# EasyEDA Pro project jlcProject.epro, schematic Schematic1_1
Create Date: 2025-04-09; Page Name: P1; Project Name: 电综; Schematic Name: Schematic1_1; Update Date: 2025-04-14; Company: 嘉立创EDA; Page Size: A4; Version: V1.0
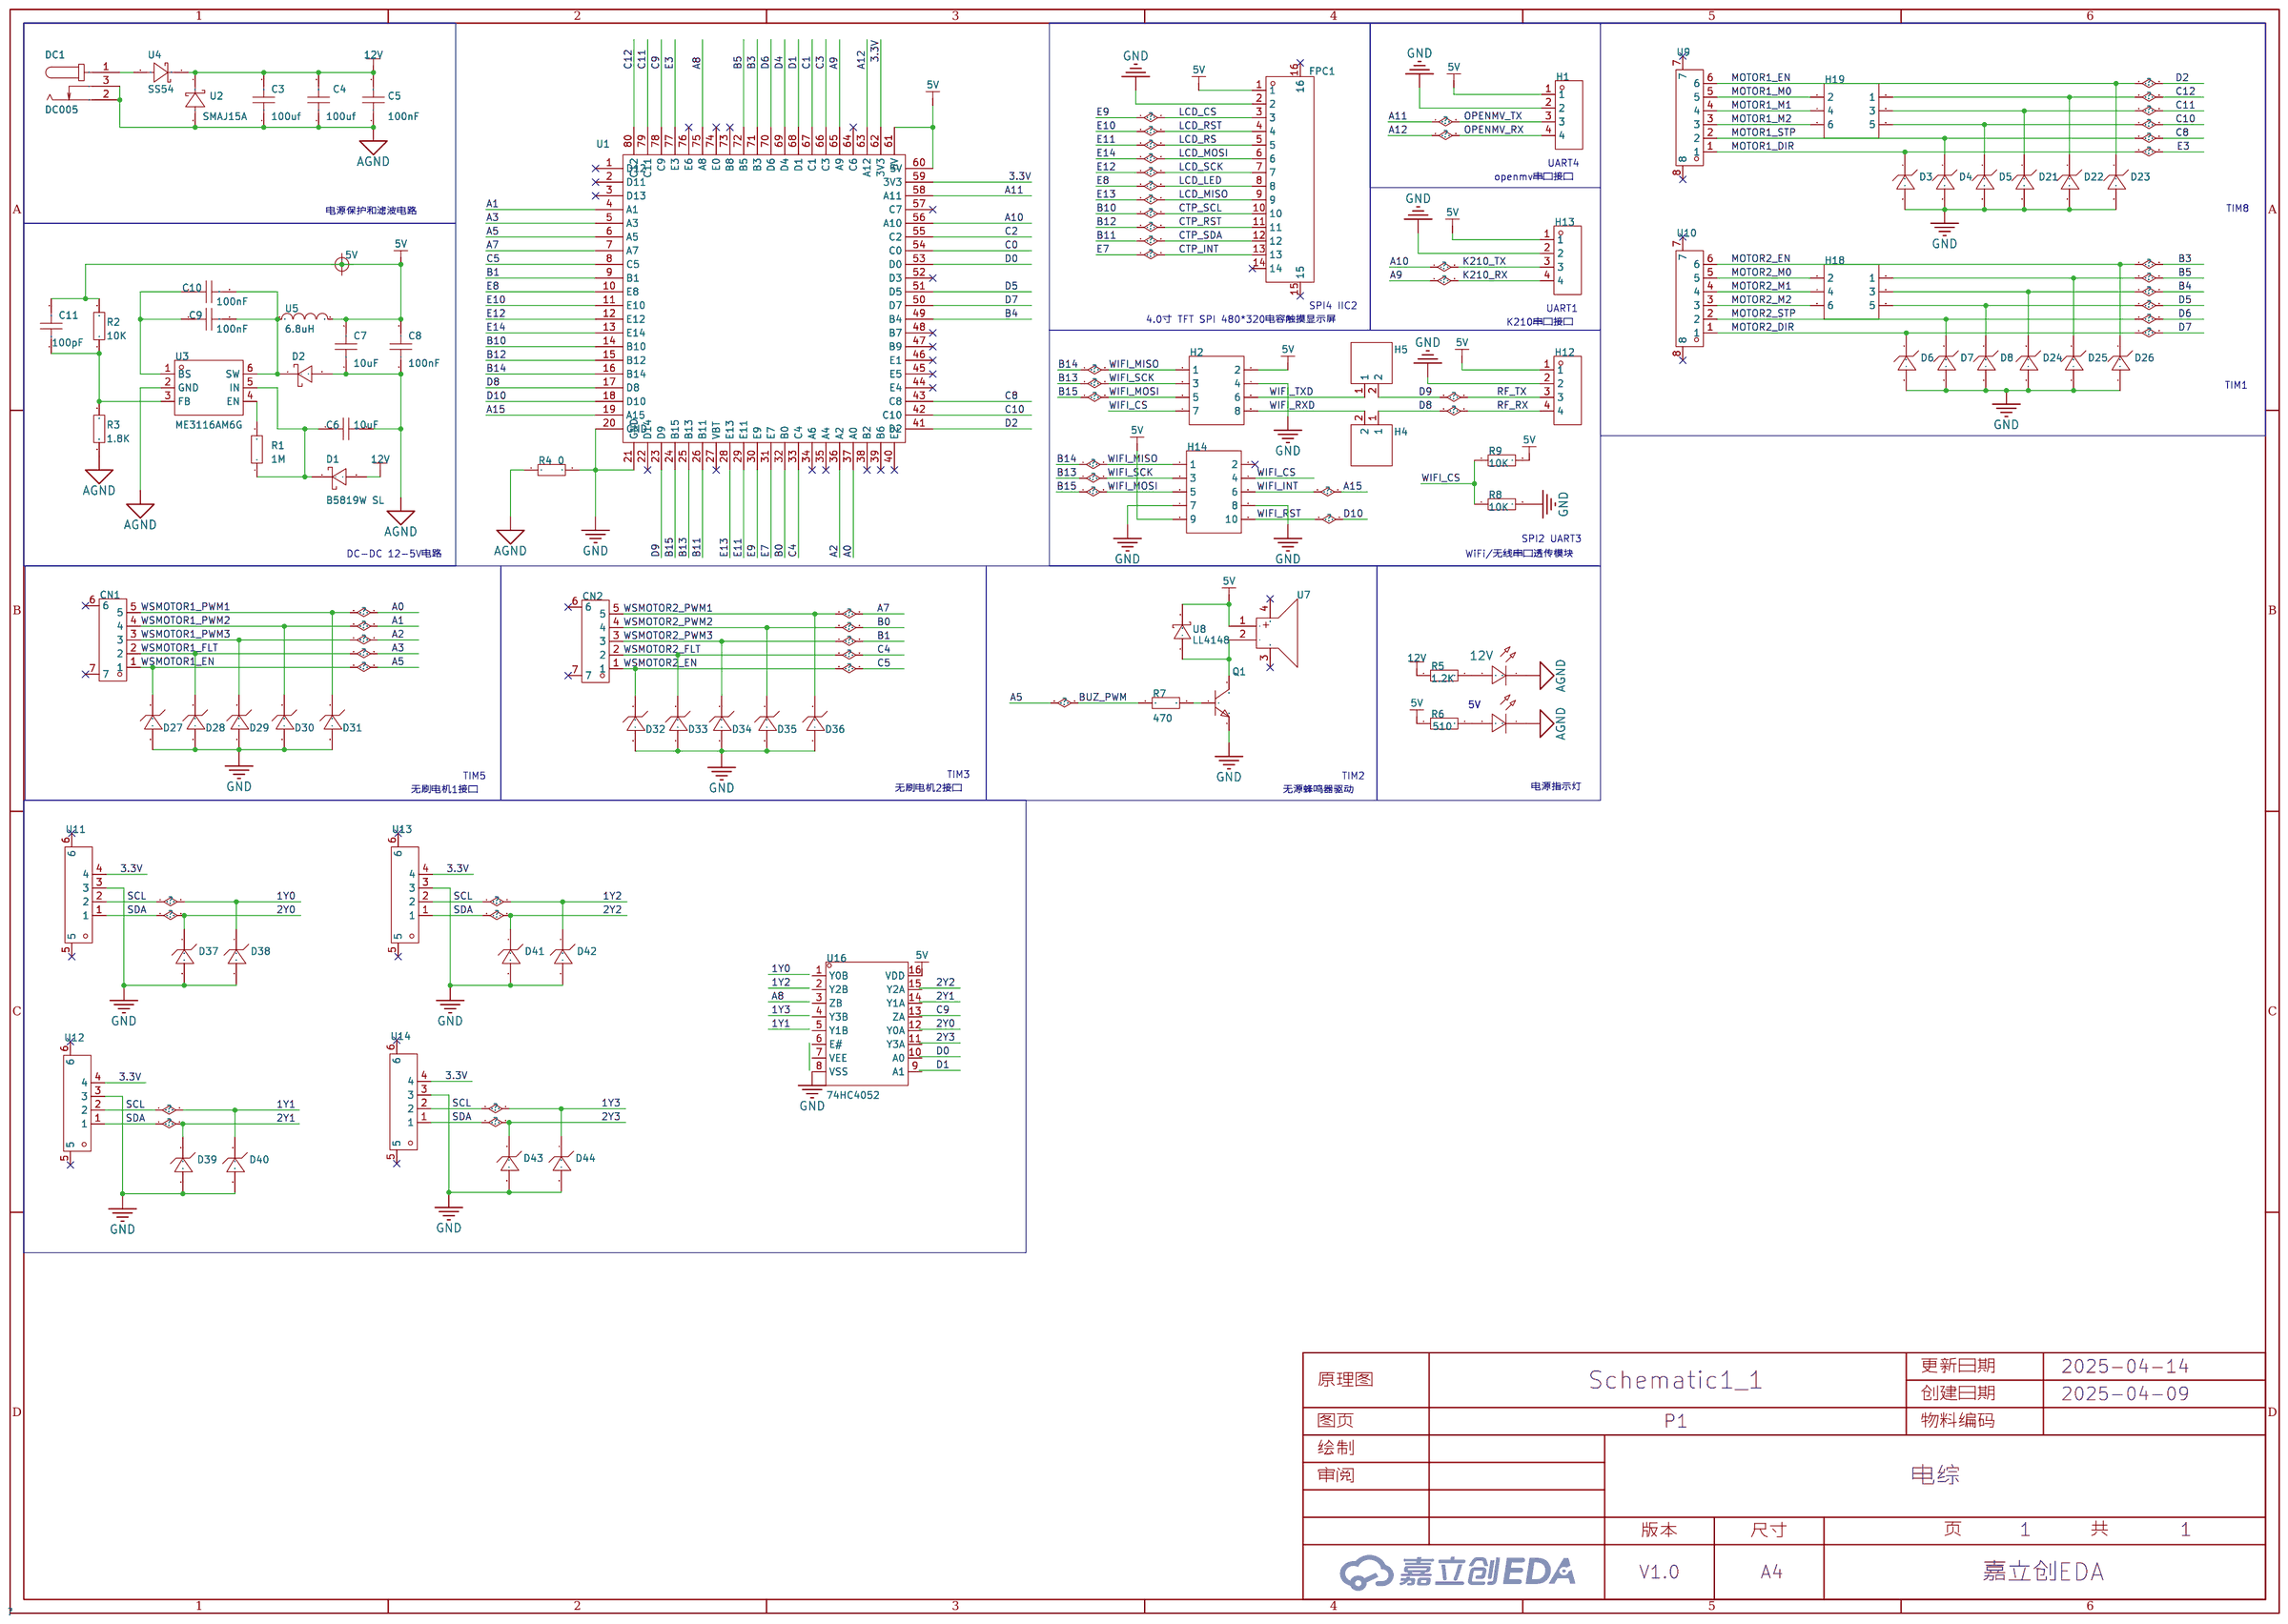
[diagram p4: schematic sheet]

## Parts
5V  -  [Mark-Point-1mm]  (no BOM)
5V#2  -  [LED_0805]
12V  -  [LED_0805]
C3  100uf  [C1206]
C4  100uf  [C1206]
C5  100nF  [C0805]
C6  10uF  [C0805]
C7  10uF  [C0805]
C8  100nF  [C0805]
C9  100nF  [C0805]
C10  100nF  [C0805]
C11  100pF  [C0805]
CN1  ZX-XH2.54-5PLT  [CONN-SMD_5P-P2.50_ZX-XH2.54-5PLT]
CN2  ZX-XH2.54-5PLT  [CONN-SMD_5P-P2.50_ZX-XH2.54-5PLT]
D1  B5819W SL  [SOD-123_L2.7-W1.6-LS3.7-RD-1]
D2  B5819W SL  [SOD-123_L2.7-W1.6-LS3.7-RD-1]
D3  SMF3.3A  [SOD-123_L2.8-W1.8-LS3.7-RD]
D4  SMF3.3A  [SOD-123_L2.8-W1.8-LS3.7-RD]
D5  SMF3.3A  [SOD-123_L2.8-W1.8-LS3.7-RD]
D6  SMF3.3A  [SOD-123_L2.8-W1.8-LS3.7-RD]
D7  SMF3.3A  [SOD-123_L2.8-W1.8-LS3.7-RD]
D8  SMF3.3A  [SOD-123_L2.8-W1.8-LS3.7-RD]
D21  SMF3.3A  [SOD-123_L2.8-W1.8-LS3.7-RD]
D22  SMF3.3A  [SOD-123_L2.8-W1.8-LS3.7-RD]
D23  SMF3.3A  [SOD-123_L2.8-W1.8-LS3.7-RD]
D24  SMF3.3A  [SOD-123_L2.8-W1.8-LS3.7-RD]
D25  SMF3.3A  [SOD-123_L2.8-W1.8-LS3.7-RD]
D26  SMF3.3A  [SOD-123_L2.8-W1.8-LS3.7-RD]
D27  SMF3.3A  [SOD-123_L2.8-W1.8-LS3.7-RD]
D28  SMF3.3A  [SOD-123_L2.8-W1.8-LS3.7-RD]
D29  SMF3.3A  [SOD-123_L2.8-W1.8-LS3.7-RD]
D30  SMF3.3A  [SOD-123_L2.8-W1.8-LS3.7-RD]
D31  SMF3.3A  [SOD-123_L2.8-W1.8-LS3.7-RD]
D32  SMF3.3A  [SOD-123_L2.8-W1.8-LS3.7-RD]
D33  SMF3.3A  [SOD-123_L2.8-W1.8-LS3.7-RD]
D34  SMF3.3A  [SOD-123_L2.8-W1.8-LS3.7-RD]
D35  SMF3.3A  [SOD-123_L2.8-W1.8-LS3.7-RD]
D36  SMF3.3A  [SOD-123_L2.8-W1.8-LS3.7-RD]
D37  SMF3.3A  [SOD-123_L2.8-W1.8-LS3.7-RD]
D38  SMF3.3A  [SOD-123_L2.8-W1.8-LS3.7-RD]
D39  SMF3.3A  [SOD-123_L2.8-W1.8-LS3.7-RD]
D40  SMF3.3A  [SOD-123_L2.8-W1.8-LS3.7-RD]
D41  SMF3.3A  [SOD-123_L2.8-W1.8-LS3.7-RD]
D42  SMF3.3A  [SOD-123_L2.8-W1.8-LS3.7-RD]
D43  SMF3.3A  [SOD-123_L2.8-W1.8-LS3.7-RD]
D44  SMF3.3A  [SOD-123_L2.8-W1.8-LS3.7-RD]
DC1  DC005  [DC-IN-TH_DC005]
FPC1  FPC-05F-14PH15  [FPC-SMD_14P-P0.50_XUNPU_FPC-05F-14PH15]
H1  -  [HDR-TH_4P-P2.54-V-F]
H2  -  [HDR-TH_8P-P2.54-V-F-R2-C4-S2.54-1]
H4  -  [HDR-TH_2P-P2.54-V-M-1]
H5  -  [HDR-TH_2P-P2.54-V-M-1]
H12  -  [HDR-TH_4P-P2.54-V-F]
H13  -  [HDR-TH_4P-P2.54-V-F]
H14  -  [HDR-TH_10P-P2.54-V-F-R2-C5-S2.54]
H18  -  [HDR-TH_6P-P2.54-V-F-R2-C3-S2.54]
H19  -  [HDR-TH_6P-P2.54-V-F-R2-C3-S2.54]
Q1  -  [S8050_SOT-23]
R1  1M  [R0805]
R2  10K  [R0805]
R3  1.8K  [R0805]
R4  0  [R0805]
R5  1.2K  [R0805]
R6  510  [R0805]
R7  470  [R0805]
R8  10K  [R0805]
R9  10K  [R0805]
U1  -  [STM32H750VBT6]
U2  SMAJ15A  [DO-214AC_L4.6-W2.8-LS5.6-RD]
U3  ME3116AM6G  [SOT-23-6_L2.9-W1.6-P0.95-LS2.8-BL]
U4  SS54  [SMA_L4.2-W2.6-LS5.1-RD]
U5  6.8uH  [IND-SMD_L7.2-W6.6_GPSR07X0]
U7  MLT-8530-5V  [BUZ-SMD_4P-L8.5-W8.5-TL]
U8  LL4148  [LL-34_L3.5-W1.5-R-RD]
U9  ZX-XH2.54-6PLT  [CONN-SMD_6P-P2.50_ZX-XH2.54-6PLT]
U10  ZX-XH2.54-6PLT  [CONN-SMD_6P-P2.50_ZX-XH2.54-6PLT]
U11  ZX-XH2.54-4PLT  [CONN-SMD_4P-P2.54_C9900012758]
U12  ZX-XH2.54-4PLT  [CONN-SMD_4P-P2.54_C9900012758]
U13  ZX-XH2.54-4PLT  [CONN-SMD_4P-P2.54_C9900012758]
U14  ZX-XH2.54-4PLT  [CONN-SMD_4P-P2.54_C9900012758]
U16  74HC4052  [SOP-16_L10.0-W3.9-P1.27-LS6.0-BL]

## Library data of the parts
5V = Mark-Point: Mark点
5V#2 = LED_0805-G: Supplier Footprint: 0805
12V = LED_0805-R: Supplier Footprint: 0805
C3 C4 = CAP_1206: Supplier Footprint: 1206
C5-C11 = CAP_0805: Supplier Footprint: 0805
CN1 CN2 = ZX-XH2.54-5PLT: 插针结构:1x5P;间距:2.5mm;安装方式:立贴;参考系列:XH;总PIN数:5P;排数:1;每排PIN数:5;行距:-;额定电流:-;触头材质:黄铜;触头镀层:锡;工作温度范围:-;; LCSC Part Name: 1x5P 间距:2.5mm 立贴 系列:XH; Supplier Part: C7429683; Manufacturer: Megastar(兆星); Supplier Footprint: SMD,P=2.5mm; JLCPCB Part Class: 扩展库; Datasheet: https://atta.szlcsc.com/upload/public/pdf/source/20230619/C44E518F22AD30B79040D9D630250EB8.pdf; Supplier: LCSC; Pins Structure: 1x5P; Pitch: 2.5mm; Mounting Type: 立贴; Reference Series: XH; Number of Pins: 5P; Number of Rows: 1; Number of PINs Per Row: 5; Contact Material: 黄铜; Contact Plating: 锡; Supplementary Features: 辅助焊脚; Color: 米色; Z-Height of the Board: 8mm; X-Length of Bottom Edge on Board (Spacing Line): 17.5mm; Y-Width of Bottom Edge on Board: 8.3mm
D1 D2 = B5819W SL: 正向压降(Vf):600mV@1A;直流反向耐压(Vr):40V;整流电流:1A;; LCSC Part Name: 电压:40V 电流:1A; Supplier Part: C8598; Manufacturer: CJ(江苏长电/长晶); Supplier Footprint: SOD-123; JLCPCB Part Class: 基础库; Datasheet: https://atta.szlcsc.com/upload/public/pdf/source/20171228/C164911_15144413243851213914.pdf; Supplier: LCSC; Forward Voltage (Vf@If): 600mV@1A; Reverse Voltage (Vr): 40V; Rectified Current: 1A
D3-D8 D21-D44 = SMF3.3A_C283866: 反向截止电压(Vrwm):3.3V;最大钳位电压:8V;峰值脉冲电流(Ipp)@10/1000us:25A;击穿电压:5.2V;; Supplier Part: C283866; Manufacturer: DOWO(东沃); Supplier Footprint: SOD-123FL; JLCPCB Part Class: Extended Part; Datasheet: https://atta.szlcsc.com/upload/public/pdf/source/20240321/1BA336232F2D97E4B026619682DB80D3.pdf; Supplier: LCSC; Reverse Stand-Off Voltage (Vrwm): 3.3V; Maximum Clamping Voltage: 8V; Peak Pulse Current (Ipp)@10/1000us: 25A; Breakdown Voltage: 5.2V; Reverse Leakage Current (Ir): 600uA; Type: TVS; Clamping Voltage: 8.3V; Peak Pulse Current (Ipp): 25A; Voltage - Breakdown: 4.2V
DC1 = DC005: 连接器类型:DC电源插座;安装方式:弯插;触点内径:2mm;触点外径:6.3mm;额定电流:500mA;额定电压:30V;工作温度范围:-25℃~+70℃;; LCSC Part Name: DC电源插座 内径:2mm 外径:6.3mm; Supplier Part: C431533; Manufacturer: SHOU HAN(首韩); Supplier Footprint: 插件; JLCPCB Part Class: Extended Part; Datasheet: https://atta.szlcsc.com/upload/public/pdf/source/20190925/C431533_4751811035784AC1D38EBC85F7905E99.pdf; Supplier: LCSC; Connector Type: DC电源插座; Mounting Style: 弯插; Inside Contact Diameter: 2mm; Outside Contact Diameter: 6.3mm; Current Rating (Max): 500mA; Voltage Rating (Max): 30V; Operating Temperature Range: -25℃~+70℃
FPC1 = FPC-05F-14PH15: 锁定特性:翻盖式;触点类型:下接;触点数量:14P;间距:0.5mm;安装类型:卧贴;工作温度范围:-25℃~+85℃;; LCSC Part Name: 间距:0.5mm P数:14P 翻盖式 下接; Supplier Part: C2856818; Manufacturer: XUNPU(讯普); Supplier Footprint: SMD,P=0.5mm,卧贴; JLCPCB Part Class: 扩展库; Datasheet: https://atta.szlcsc.com/upload/public/pdf/source/20210922/C2856818_BF9A09706769A6AB1B749235C5052B10.pdf; Supplier: LCSC; Locking Feature: 翻盖式; Contact Type: 下接; Number of Contacts: 14P; Pitch: 0.5mm; Mounting Type: 卧贴; FFC, FCB Thickness: 0.3mm; Height Above Board: 1.5mm; Operating Temperature Range: -25℃~+85℃
H1 H12 H13 = HDR-F_2.54_1x4P: Supplier Part: C2718488; Supplier Footprint: 插件
H2 = HDR-F_2.54_2x4: Supplier Part: C92271; Supplier Footprint: 插件
H4 H5 = HDR-M_2.54_1x2P: Supplier Part: C124375; Supplier Footprint: 插件
H14 = HDR-F_2.54_2x5: Supplier Part: C92270; Supplier Footprint: 插件
H18 H19 = HDR-F_2.54_2x3: Supplier Part: C92272; Supplier Footprint: 插件
Q1 = S8050_SOT_NPN: Supplier Footprint: SOT-23
R1-R9 = Res_0805: Supplier Footprint: 0805
U1 = STM32H750VBT6核心板
U2 = SMAJ15A_C5339847: 极性:单向;反向截止电压(Vrwm):15V;最大钳位电压:24.4V;峰值脉冲电流(Ipp):16.39A;峰值脉冲功率(Ppp):400W;击穿电压:16.7V;; Supplier Part: C5339847; Manufacturer: YANGJIE(扬杰); Supplier Footprint: SMA(DO-214AC); JLCPCB Part Class: Extended Part; Datasheet: https://atta.szlcsc.com/upload/public/pdf/source/20240417/078E1BEAC4554065E7AD0D3CFE8DBE37.pdf; Supplier: LCSC; polarity: 单向; Reverse Stand-Off Voltage (Vrwm): 15V; Maximum Clamping Voltage: 24.4V; Peak Pulse Current (Ipp): 16.39A; Peak Pulse Power Dissipation (Ppp): 400W; Breakdown Voltage: 16.7V; Type: TVS
U3 = ME3116AM6G: Supplier Part: C427569; Supplier Footprint: SOT-23-6; JLCPCB Part Class: Extended Part; Supplier: LCSC
U4 = SS54: Supplier Part: C9900023219; Supplier Footprint: (1N5824)DO-214; JLCPCB Part Class: 扩展库; Supplier: LCSC
U5 = CYA0630-4.7UH: 电感值:4.7uH;精度:±20%;额定电流:5A;直流电阻(DCR):34.5mΩ;; LCSC Part Name: 4.7uH ±20%; Supplier Part: C5189748; Manufacturer: SHOU HAN(首韩); Supplier Footprint: SMD,7.2x6.6mm; JLCPCB Part Class: Extended Part; Datasheet: https://atta.szlcsc.com/upload/public/pdf/source/20221010/79ACBE86DD414F23A670753564343C1B.pdf; Supplier: LCSC; Tolerance: ±20%; Rated Current: 5A; DC Resistance (DCR): 34.5mΩ
U7 = MLT-8530-5V: Supplier Part: C9900014013; Supplier Footprint: 8530; JLCPCB Part Class: 扩展库; Supplier: LCSC
U8 = LL4148: Supplier Part: C9900015984; Supplier Footprint: MINI_MELF(LL34); JLCPCB Part Class: 扩展库; Supplier: LCSC
U9 U10 = ZX-XH2.54-6PLT: 插针结构:1x6P;间距:2.5mm;安装方式:立贴;参考系列:XH;总PIN数:6P;排数:1;每排PIN数:6;行距:-;额定电流:-;触头材质:黄铜;触头镀层:锡;工作温度范围:-;; LCSC Part Name: 1x6P 间距:2.5mm 立贴 系列:XH; Supplier Part: C7429684; Manufacturer: Megastar(兆星); Supplier Footprint: SMD,P=2.5mm; JLCPCB Part Class: 扩展库; Datasheet: https://atta.szlcsc.com/upload/public/pdf/source/20230619/BCBF0CFD05E3F8E61711B90D8A4988B4.pdf; Supplier: LCSC; Pins Structure: 1x6P; Pitch: 2.5mm; Mounting Type: 立贴; Reference Series: XH; Number of Pins: 6P; Number of Rows: 1; Number of PINs Per Row: 6; Contact Material: 黄铜; Contact Plating: 锡; Supplementary Features: 辅助焊脚; Color: 米色; Z-Height of the Board: 8mm; X-Length of Bottom Edge on Board (Spacing Line): 20mm; Y-Width of Bottom Edge on Board: 8.3mm
U11-U14 = ZX-XH2.54-4PLT: 插针结构:1x4P;间距:2.5mm;安装方式:立贴;参考系列:XH;总PIN数:4P;排数:1;每排PIN数:4;行距:-;额定电流:-;触头材质:黄铜;触头镀层:锡;工作温度范围:-;; LCSC Part Name: 1x4P 间距:2.5mm 立贴 系列:XH; Supplier Part: C7429682; Manufacturer: Megastar(兆星); Supplier Footprint: SMD,P=2.5mm; JLCPCB Part Class: Extended Part; Datasheet: https://atta.szlcsc.com/upload/public/pdf/source/20230619/0839CF43A4681B40F50854985C226EB8.pdf; Supplier: LCSC; Pins Structure: 1x4P; Pitch: 2.5mm; Mounting Type: 立贴; Reference Series: XH; Number of Pins: 4P; Number of Rows: 1; Number of PINs Per Row: 4; Contact Material: 黄铜; Contact Plating: 锡; Supplementary Features: 辅助焊脚; Color: 米色; Z-Height of the Board: 8mm; X-Length of Bottom Edge on Board (Spacing Line): 15mm; Y-Width of Bottom Edge on Board: 8.3mm
U16 = 74HC4052: 开关电路:-;; Supplier Part: C111594; Manufacturer: I-CORE(中微爱芯); Supplier Footprint: SOP-16; JLCPCB Part Class: 扩展库; Datasheet: https://atta.szlcsc.com/upload/public/pdf/source/20181218/C111594_78C9BE2F6C155C21DD98422DA401F462.pdf; Supplier: LCSC

## Nets
3.3V: U1.59(3V3) U1.62(3V3) U11.4 U12.4 U13.4 U14.4
5V: 5V.1 C7.2 C8.2 C11.2 FPC1.1 H1.1 H2.2 H12.1 H13.1 H14.9 R2.2 R6.1 R9.2 U1.60(5V) U1.61(5V) U5.2 U7.1(+) U8.2(C) U16.16(VDD)
12V: C3.2 C4.2 C5.2 D1.2(+) R5.1 U2.1(C) U4.1(C)
AGND: 5V#2.1(C) 12V.1(C) C3.1 C4.1 C5.1 C6.2 C7.1 C8.1 D2.2(+) DC1.2 DC1.3 R3.1 R4.1 U2.2(A) U3.2(GND)
GND: D3.2(A) D4.2(A) D5.2(A) D6.2(A) D7.2(A) D8.2(A) D21.2(A) D22.2(A) D23.2(A) D24.2(A) D25.2(A) D26.2(A) D27.2(A) D28.2(A) D29.2(A) D30.2(A) D31.2(A) D32.2(A) D33.2(A) D34.2(A) D35.2(A) D36.2(A) D37.2(A) D38.2(A) D39.2(A) D40.2(A) D41.2(A) D42.2(A) D43.2(A) D44.2(A) FPC1.2 H1.2 H2.4 H12.2 H13.2 H14.7 H14.8 Q1.2 R4.2 R8.2 U1.20(GND) U1.21(GND) U11.3 U12.3 U13.3 U14.3 U16.8(VSS)
1Y0: D38.1(C) D40.1(C) D42.1(C) D44.1(C) U11.2 U12.2 U13.2 U14.2
2Y0: D37.1(C) D39.1(C) D41.1(C) D43.1(C) U11.1 U12.1 U13.1 U14.1
A0: CN1.5 D31.1(C) U1.37(A0)
A1: CN1.4 D30.1(C) U1.4(A1)
A2: CN1.3 D29.1(C) U1.36(A2)
A3: CN1.2 D28.1(C) U1.5(A3)
A5: CN1.1 D27.1(C) R7.1 U1.6(A5)
A7: CN2.5 D36.1(C) U1.7(A7)
A8: U1.75(A8)
A9: H13.4 U1.65(A9)
A10: H13.3 U1.56(A10)
A11: H1.3 U1.58(A11)
A12: H1.4 U1.63(A12)
A15: H14.6 U1.19(A15)
B0: CN2.4 D35.1(C) U1.32(B0)
B1: CN2.3 D34.1(C) U1.9(B1)
B3: D26.1(C) U1.71(B3) U10.6
B4: D24.1(C) H18.3 U1.49(B4)
B5: D25.1(C) H18.1 U1.72(B5)
B10: FPC1.10 U1.14(B10)
B11: FPC1.12 U1.26(B11)
B12: FPC1.11 U1.15(B12)
B13: H2.3 H14.3 U1.25(B13)
B14: H2.1 H14.1 U1.16(B14)
B15: H2.5 H14.5 U1.24(B15)
C0: U1.54(C0)
C1: U1.67(C1)
C2: U1.55(C2)
C3: U1.66(C3)
C4: CN2.2 D33.1(C) U1.33(C4)
C5: CN2.1 D32.1(C) U1.8(C5)
C8: D4.1(C) U1.43(C8) U9.2
C9: U1.78(C9)
C10: D5.1(C) H19.5 U1.42(C10)
C11: D21.1(C) H19.3 U1.79(C11)
C12: D22.1(C) H19.1 U1.80(C12)
CTP_INT: FPC1.13 U1.31(E7)
D0: U1.53(D0)
D1: U1.68(D1)
D2: D23.1(C) U1.41(D2) U9.6
D4: U1.69(D4)
D5: D8.1(C) H18.5 U1.51(D5)
D6: D7.1(C) U1.70(D6) U10.2
D7: D6.1(C) U1.50(D7) U10.1
D8: H4.1 H12.4 U1.17(D8)
D9: H5.2 H12.3 U1.23(D9)
D10: H14.10 U1.18(D10)
E3: D3.1(C) U1.77(E3) U9.1
E8: FPC1.8 U1.10(E8)
E9: FPC1.3 U1.30(E9)
E10: FPC1.4 U1.11(E10)
E11: FPC1.5 U1.29(E11)
E12: FPC1.7 U1.12(E12)
E13: FPC1.9 U1.28(E13)
E14: FPC1.6 U1.13(E14)
MOTOR1_M0: H19.2 U9.5
MOTOR1_M1: H19.4 U9.4
MOTOR1_M2: H19.6 U9.3
MOTOR2_M0: H18.2 U10.5
MOTOR2_M1: H18.4 U10.4
MOTOR2_M2: H18.6 U10.3
WIFI_CS: H2.7 H14.4 R8.1 R9.1
WIFI_RXD: H2.8 H4.2
WIFI_TXD: H2.6 H5.1
$1N1047: DC1.1 U4.2(A)
$1N1464: R1.2 U3.4(EN)
$1N1552: C6.1 D1.1(-) R1.1 U3.5(IN)
$1N1848: C9.1 C10.1 U3.1(BS)
$1N1857: C9.2 C10.2 D2.1(-) U3.6(SW) U5.1
$1N2145: C11.1 R2.1 R3.2 U3.3(FB)
$1N4604: 12V.2(A) R5.2
$1N5073: Q1.3 U7.2(-) U8.1(A)
$1N5102: Q1.1 R7.2
Net-(5V#2-2): 5V#2.2(A) R6.2

Not connected (* = marked no-connect by the designer): CN1 6* 7*; CN2 6* 7*; FPC1 14* 15* 16*; H14 2*; U1 1(D12)* 2(D11)* 3(D13)* 22(D14)* 27(VBT)* 34(A6)* 35(A4)* 38(B2)* 39(B6)* 40(E2)* 44(E4)* 45(E5)* 46(E1)* 47(B9)* 48(B7)* 52(D3)* 57(C7)* 64(C6)* 73(B8)* 74(E0)* 76(E6)*; U7 3(NC)* 4(NC)*; U9 7* 8*; U10 7* 8*; U11 5* 6*; U12 5* 6*; U13 5* 6*; U14 5* 6*; U16 1(Y0B) 2(Y2B) 3(ZB) 4(Y3B) 5(Y1B) 6(E#) 7(VEE) 9(A1) 10(A0) 11(Y3A) 12(Y0A) 13(ZA) 14(Y1A) 15(Y2A)

## Notes on the sheet
- UART4
- openmv串口接口
- 电源保护和滤波电路
- TIM8
- 4.0寸 TFT SPI 480*320电容触摸显示屏
- SPI4 IIC2
- UART1
- K210串口接口
- TIM1
- SPI2 UART3
- DC-DC 12-5V电路
- WiFi/无线串口透传模块
- TIM5
- 无刷电机2接口
- TIM3
- TIM2
- 电源指示灯
- 无刷电机1接口
- 无源蜂鸣器驱动
